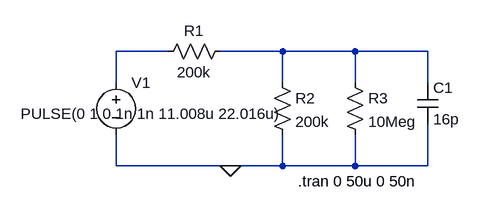
[diagram p0: schematic Exp4Part2c.asc]
Exp4Part2c.asc, the LTspice schematic file:
Version 4
SHEET 1 880 680
WIRE 48 -80 -32 -80
WIRE 224 -80 128 -80
WIRE 336 -80 224 -80
WIRE 448 -80 336 -80
WIRE -32 -32 -32 -80
WIRE 224 -32 224 -80
WIRE 336 -32 336 -80
WIRE 448 -32 448 -80
WIRE -32 96 -32 48
WIRE 144 96 -32 96
WIRE 224 96 224 48
WIRE 224 96 144 96
WIRE 336 96 336 48
WIRE 336 96 224 96
WIRE 448 96 448 32
WIRE 448 96 336 96
FLAG 144 96 0
SYMBOL res 144 -96 R90
WINDOW 0 0 56 VBottom 2
WINDOW 3 32 56 VTop 2
SYMATTR InstName R1
SYMATTR Value 200k
SYMBOL res 208 -48 R0
SYMATTR InstName R2
SYMATTR Value 200k
SYMBOL voltage -32 -48 R0
WINDOW 123 -105 43 Left 2
WINDOW 39 0 0 Left 0
WINDOW 3 -147 64 Left 2
SYMATTR InstName V1
SYMATTR Value PULSE(0 1 0 1n 1n 11.008u 22.016u)
SYMBOL res 320 -48 R0
SYMATTR InstName R3
SYMATTR Value 10Meg
SYMBOL cap 432 -32 R0
SYMATTR InstName C1
SYMATTR Value 16p
TEXT 248 120 Left 2 !.tran 0 50u 0 50n

The netlist it stands for:
* Exp4Part2c.asc
R1 N002 N001 200k
R2 N002 0 200k
V1 N001 0 PULSE(0 1 0 1n 1n 11.008u 22.016u)
R3 N002 0 10Meg
C1 N002 0 16p
.tran 0 50u 0 50n
.backanno
.end